# EAGLE design tamagotya (EAGLE 9.4.0)

## Sheet 1 of 4
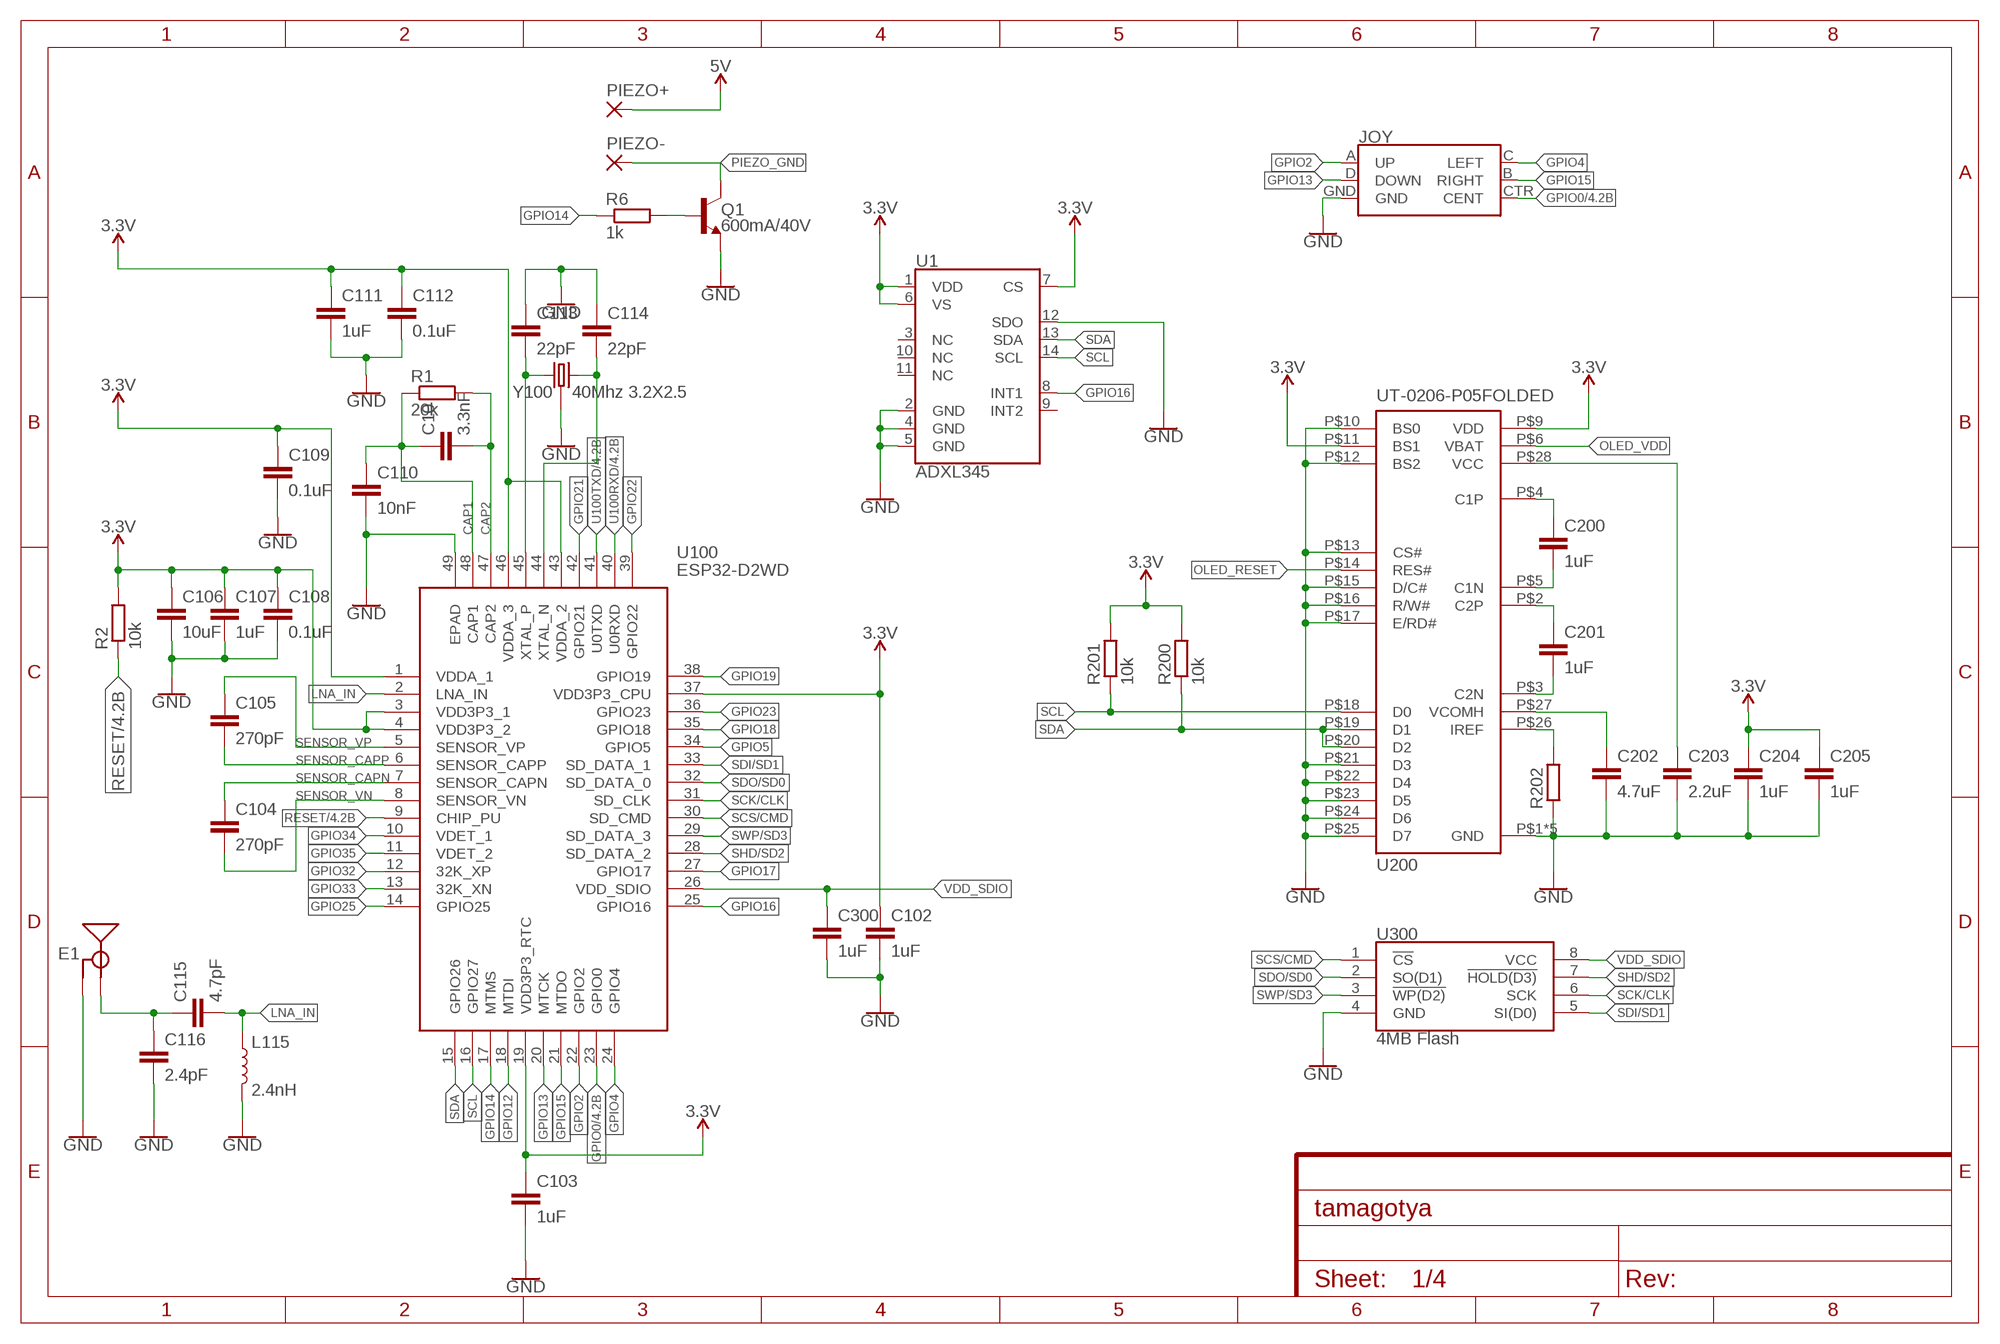
[diagram p0: schematic, sheet 1]

### Parts
C10  3.3nF  C-EUC0603  [C0603]
C102  1uF  C-EUC0603  [C0603]
C103  1uF  C-EUC0603  [C0603]
C104  270pF  C-EUC0603  [C0603]
C105  270pF  C-EUC0603  [C0603]
C106  10uF  C-EUC0603  [C0603]
C107  1uF  C-EUC0603  [C0603]
C108  0.1uF  C-EUC0603  [C0603]
C109  0.1uF  C-EUC0603  [C0603]
C110  10nF  C-EUC0603  [C0603]
C111  1uF  C-EUC0603  [C0603]
C112  0.1uF  C-EUC0603  [C0603]
C113  22pF  C-EUC0603  [C0603]
C114  22pF  C-EUC0603  [C0603]
C115  4.7pF  C-EUC0603  [C0603]
C116  2.4pF  C-EUC0603  [C0603]
C200  1uF  C-EUC0603  [C0603]
C201  1uF  C-EUC0603  [C0603]
C202  4.7uF  C-EUC0603  [C0603]
C203  2.2uF  C-EUC0603  [C0603]
C204  1uF  C-EUC0603  [C0603]
C205  1uF  C-EUC0603  [C0603]
C300  1uF  C-EUC0603  [C0603]
E1  ANTENNA-GROUNDEDTRACE-15.2MM  [TRACE_ANTENNA_2.4GHZ_15.2MM]
JOY  JOYSTICK_MINI  [JOYSTICK_MINI]
L115  2.4nH  INDUCTOR-0603-33NH  [0603]
PIEZO+  WIREPADSMD1,27-254  [SMD1,27-2,54]
PIEZO-  WIREPADSMD1,27-254  [SMD1,27-2,54]
Q1  600mA/40V  TRANS_NPN-MMBT2222AL  [SOT23-3]
R1  20k  R-EU_R0603  [R0603]
R2  10k  R-EU_R0603  [R0603]
R6  1k  R-EU_R0603  [R0603]
R200  10k  R-EU_R0603  [R0603]
R201  10k  R-EU_R0603  [R0603]
R202  R-EU_R0603  [R0603]
U1  ADXL345  [LGA-14]
U100  ESP32-D2WD  [QFN35P500X500X90-49N]
U200  UT-0206-P05FOLDED  [UT-0206-P05-FOLD]
U300  4MB Flash  AT25SF041  [SO08]
Y100  40Mhz 3.2X2.5  CRYSTAL-26MHZSMD-3.2X2.5  [CRYSTAL-SMD-3.2X2.5MM]

### Nets
3.3V: C102.1 C103.1 C106.1 C107.1 C108.1 C109.1 C111.1 C112.1 C204.1 C205.1 R2.2 R200.2 R201.2 U1.1(VDD) U1.6(VS) U1.7(CS) U100.1(VDDA_1) U100.3(VDD3P3_1) U100.4(VDD3P3_2) U100.19(VDD3P3_RTC) U100.37(VDD3P3_CPU) U100.43(VDDA_2) U100.46(VDDA_3) U200.P$9(VDD) U200.P$11(BS1) ; also sheet 3
5V: PIEZO+.1(P) ; also sheet 3
CAP1: C10.1 C110.1 R1.1 U100.48(CAP1)
CAP2: C10.2 R1.2 U100.47(CAP2)
GND: C102.2 C103.2 C106.2 C107.2 C108.2 C109.2 C110.2 C111.2 C112.2 C113.1 C114.1 C116.2 C202.2 C203.2 C204.2 C205.2 C300.2 E1.GND JOY.GND L115.2 Q1.2(E) R202.1 U1.2(GND) U1.4(GND) U1.5(GND) U1.12(SDO) U100.49(EPAD) U200.P$1(GND) U200.P$7(GND) U200.P$8(GND) U200.P$10(BS0) U200.P$12(BS2) U200.P$13(CS#) U200.P$15(D/C#) U200.P$16(R/W#) U200.P$17(E/RD#) U200.P$21(D3) U200.P$22(D4) U200.P$23(D5) U200.P$24(D6) U200.P$25(D7) U200.P$29(GND) U200.P$30(GND) U300.4(GND) Y100.2 Y100.4 ; also sheet 2,3,4
GPIO0: JOY.CTR(CENT) U100.23(GPIO0) ; also sheet 4
GPIO2: JOY.A(UP) U100.22(GPIO2)
GPIO4: JOY.C(LEFT) U100.24(GPIO4)
GPIO5: U100.34(GPIO5)
GPIO12: U100.18(MTDI)
GPIO13: JOY.D(DOWN) U100.20(MTCK)
GPIO14: R6.1 U100.17(MTMS)
GPIO15: JOY.B(RIGHT) U100.21(MTDO)
GPIO16: U1.8(INT1) U100.25(GPIO16)
GPIO17: U100.27(GPIO17)
GPIO18: U100.35(GPIO18)
GPIO19: U100.38(GPIO19)
GPIO21: U100.42(GPIO21)
GPIO22: U100.39(GPIO22)
GPIO23: U100.36(GPIO23)
GPIO25: U100.14(GPIO25)
GPIO32: U100.12(32K_XP)
GPIO33: U100.13(32K_XN)
GPIO34: U100.10(VDET_1)
GPIO35: U100.11(VDET_2)
LNA_IN: C115.2 L115.1 U100.2(LNA_IN)
N$5: Q1.1(B) R6.2
N$7: C115.1 C116.1 E1.ANT(SIGNAL)
N$10: R202.2 U200.P$26(IREF)
N$11: C202.1 U200.P$27(VCOMH)
N$12: C200.1 U200.P$4(C1P)
N$13: C200.2 U200.P$5(C1N)
N$14: C201.1 U200.P$2(C2P)
N$15: C201.2 U200.P$3(C2N)
N$16: C203.1 U200.P$28(VCC)
OLED_RESET: U200.P$14(RES#)
OLED_VDD: U200.P$6(VBAT)
PIEZO_GND: PIEZO-.1(P) Q1.3(C)
RESET: R2.1 U100.9(CHIP_PU) ; also sheet 4
SCK/CLK: U100.31(SD_CLK) U300.6(SCK)
SCL: R201.1 U1.14(SCL) U100.16(GPIO27) U200.P$18(D0)
SCS/CMD: U100.30(SD_CMD) U300.1(!CS)
SDA: R200.1 U1.13(SDA) U100.15(GPIO26) U200.P$19(D1) U200.P$20(D2)
SDI/SD1: U100.33(SD_DATA_1) U300.5(SI(D0))
SDO/SD0: U100.32(SD_DATA_0) U300.2(SO(D1))
SENSOR_CAPN: C104.1 U100.7(SENSOR_CAPN)
SENSOR_CAPP: C105.2 U100.6(SENSOR_CAPP)
SENSOR_VN: C104.2 U100.8(SENSOR_VN)
SENSOR_VP: C105.1 U100.5(SENSOR_VP) ; also sheet 2
SHD/SD2: U100.28(SD_DATA_2) U300.7(!HOLD(D3))
SWP/SD3: U100.29(SD_DATA_3) U300.3(!WP(D2))
U100RXD: U100.40(U0RXD) ; also sheet 4
U100TXD: U100.41(U0TXD) ; also sheet 4
VDD_SDIO: C300.1 U100.26(VDD_SDIO) U300.8(VCC)
XTAL_P: C113.2 U100.45(XTAL_P) Y100.1
XTAN_N: C114.2 U100.44(XTAL_N) Y100.3
Unconnected: U1.3(NC) U1.9(INT2) U1.10(NC) U1.11(NC)

## Sheet 2 of 4: Charge Circuit
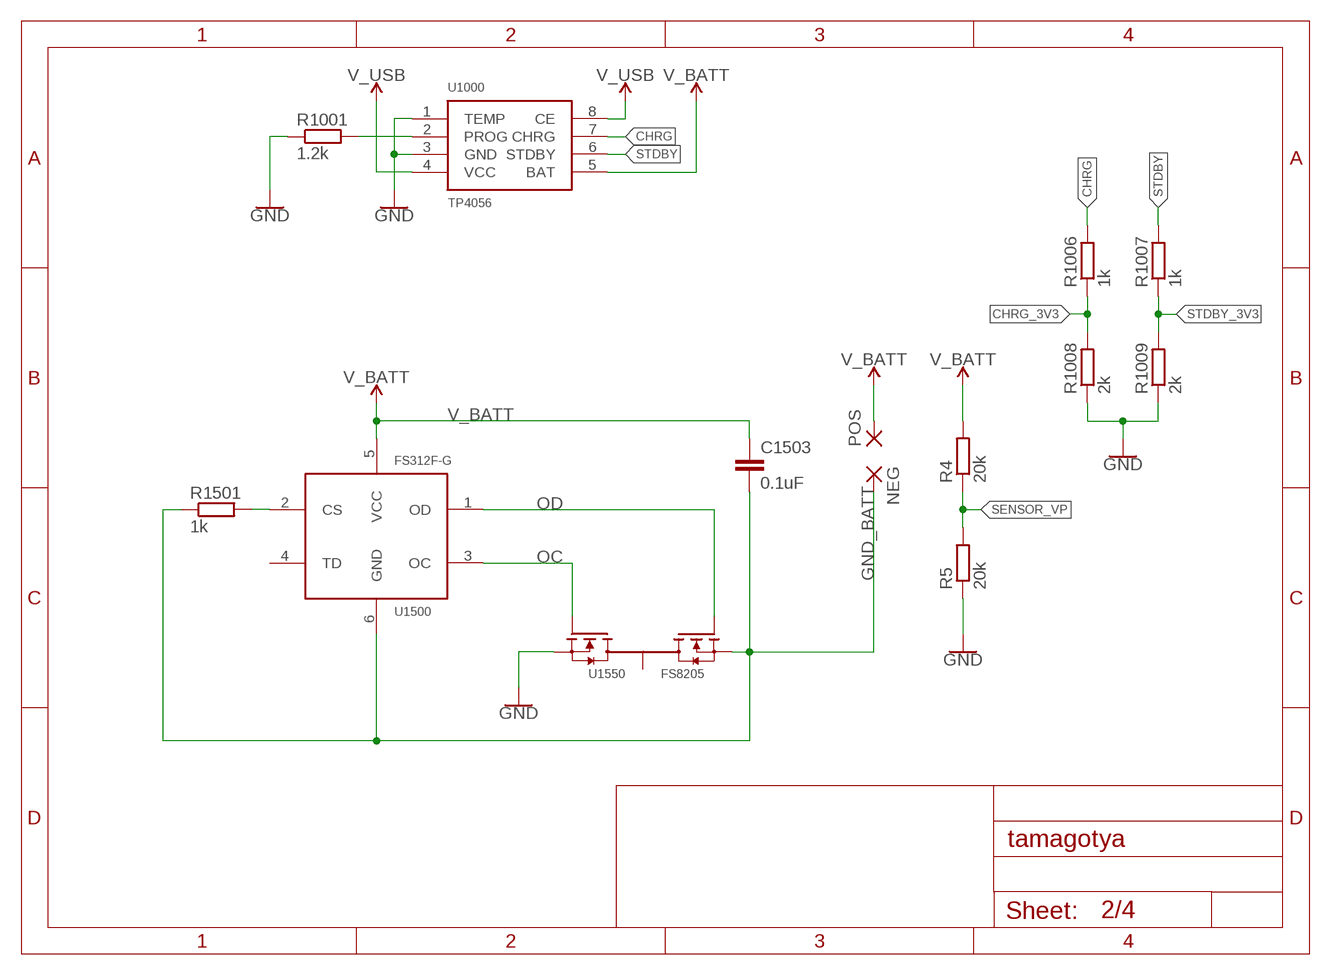
[diagram p1: schematic, sheet 2]

### Parts
C1503  0.1uF  C-EUC0603  [C0603]
NEG  SMD5  [SMD2,54-5,08]
POS  SMD5  [SMD2,54-5,08]
R4  20k  R-EU_R0603  [R0603]
R5  20k  R-EU_R0603  [R0603]
R1001  1.2k  R-EU_R0603  [R0603]
R1006  1k  R-EU_R0603  [R0603]
R1007  1k  R-EU_R0603  [R0603]
R1008  2k  R-EU_R0603  [R0603]
R1009  2k  R-EU_R0603  [R0603]
R1501  1k  R-EU_R0603  [R0603]
U1000  TP4056  [SOP-8]
U1500  FS312F-G  [SOT23-6]
U1550  FS8205  [SOT23-6]

### Nets
CHRG: R1006.2 U1000.7(CHRG)
CHRG_3V3: R1006.1 R1008.2
FS_CS: R1501.2 U1500.2(CS)
GND: R5.1 R1001.1 R1008.1 R1009.1 U1000.1(TEMP) U1000.3(GND) U1550.1(S1) ; also sheet 1,3,4
GND_BATT: C1503.2 NEG.1(P) R1501.1 U1500.6(GND) U1550.3(S2)
N$4: R1001.2 U1000.2(PROG)
OC: U1500.3(OC) U1550.6(G1)
OD: U1500.1(OD) U1550.4(G2)
SENSOR_VP: R4.1 R5.2 ; also sheet 1
STDBY: R1007.2 U1000.6(STDBY)
STDBY_3V3: R1007.1 R1009.2
V_BATT: C1503.1 POS.1(P) R4.2 U1000.5(BAT) U1500.5(VCC) ; also sheet 3
V_USB: U1000.4(VCC) U1000.8(CE) ; also sheet 4
Unconnected: U1500.4(TD) U1550.2(D12) U1550.5(D12)

## Sheet 3 of 4: Regulators
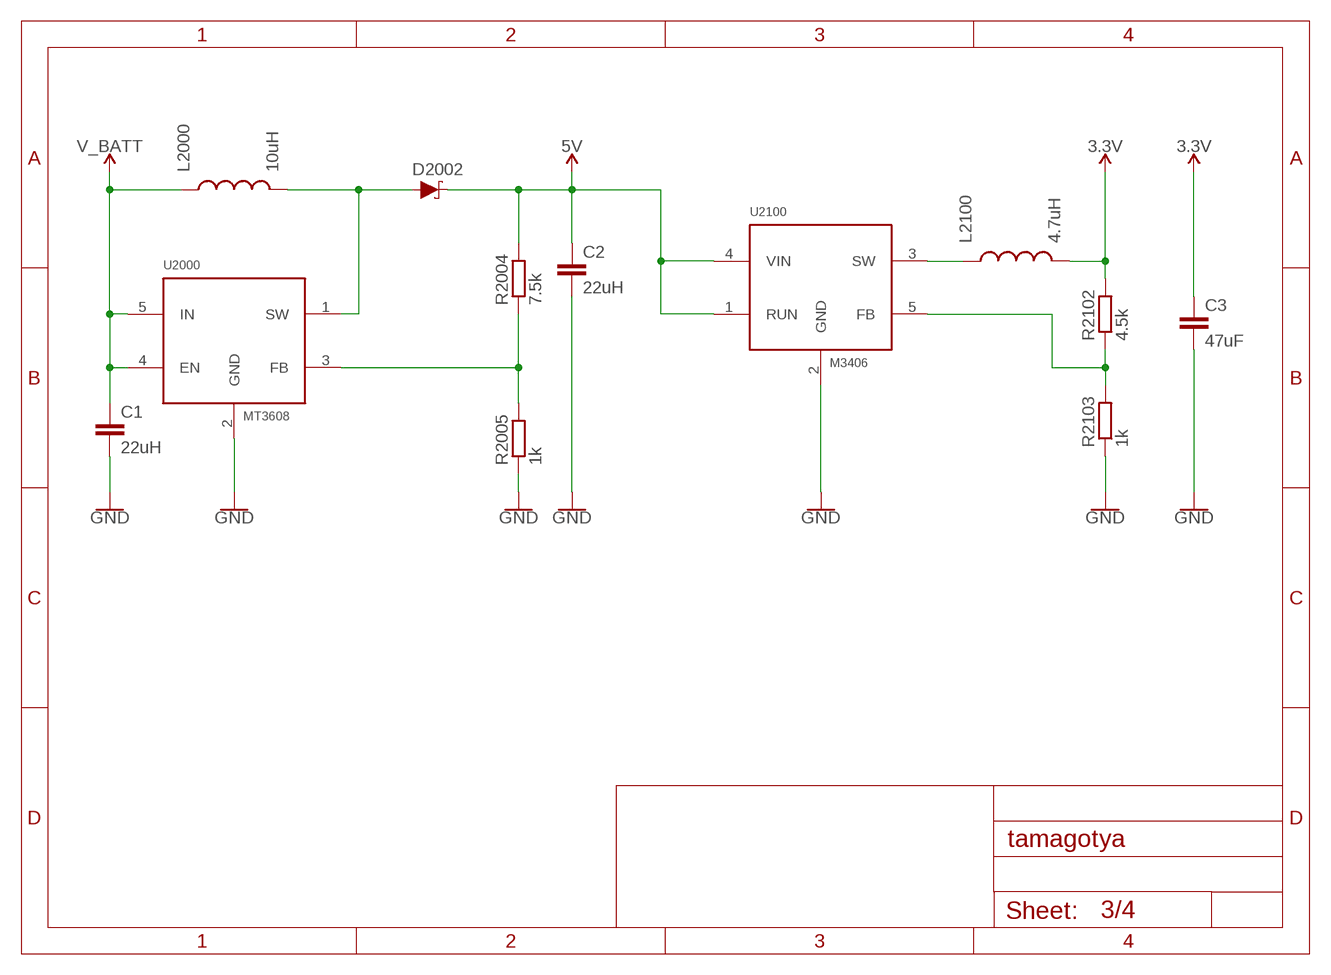
[diagram p2: schematic, sheet 3]

### Parts
C1  22uH  C-EUC0603  [C0603]
C2  22uH  C-EUC0603  [C0603]
C3  47uF  C-EUC0805  [C0805]
D2002  DIODE-SCHOTTKY-PMEG4005EJ  [SOD-323]
L2000  10uH  INDUCTOR3.0X3.0  [INDUCTOR_3.0X3.0]
L2100  4.7uH  INDUCTOR3.0X3.0  [INDUCTOR_3.0X3.0]
R2004  7.5k  R-EU_R0603  [R0603]
R2005  1k  R-EU_R0603  [R0603]
R2102  4.5k  R-EU_R0603  [R0603]
R2103  1k  R-EU_R0603  [R0603]
U2000  MT3608  [SOT23-6]
U2100  M3406  [SOT23-5]

### Nets
3.3V: C3.1 L2100.P$2 R2102.2 ; also sheet 1
5V: C2.1 D2002.C R2004.2 U2100.1(RUN) U2100.4(VIN) ; also sheet 1
BUCK: D2002.A L2000.P$2 U2000.1(SW)
GND: C1.2 C2.2 C3.2 R2005.1 R2103.1 U2000.2(GND) U2100.2(GND) ; also sheet 1,2,4
N$3: R2004.1 R2005.2 U2000.3(FB)
N$8: L2100.P$1 U2100.3(SW)
N$9: R2102.1 R2103.2 U2100.5(FB)
V_BATT: C1.1 L2000.P$1 U2000.4(EN) U2000.5(IN) ; also sheet 2

## Sheet 4 of 4: UART
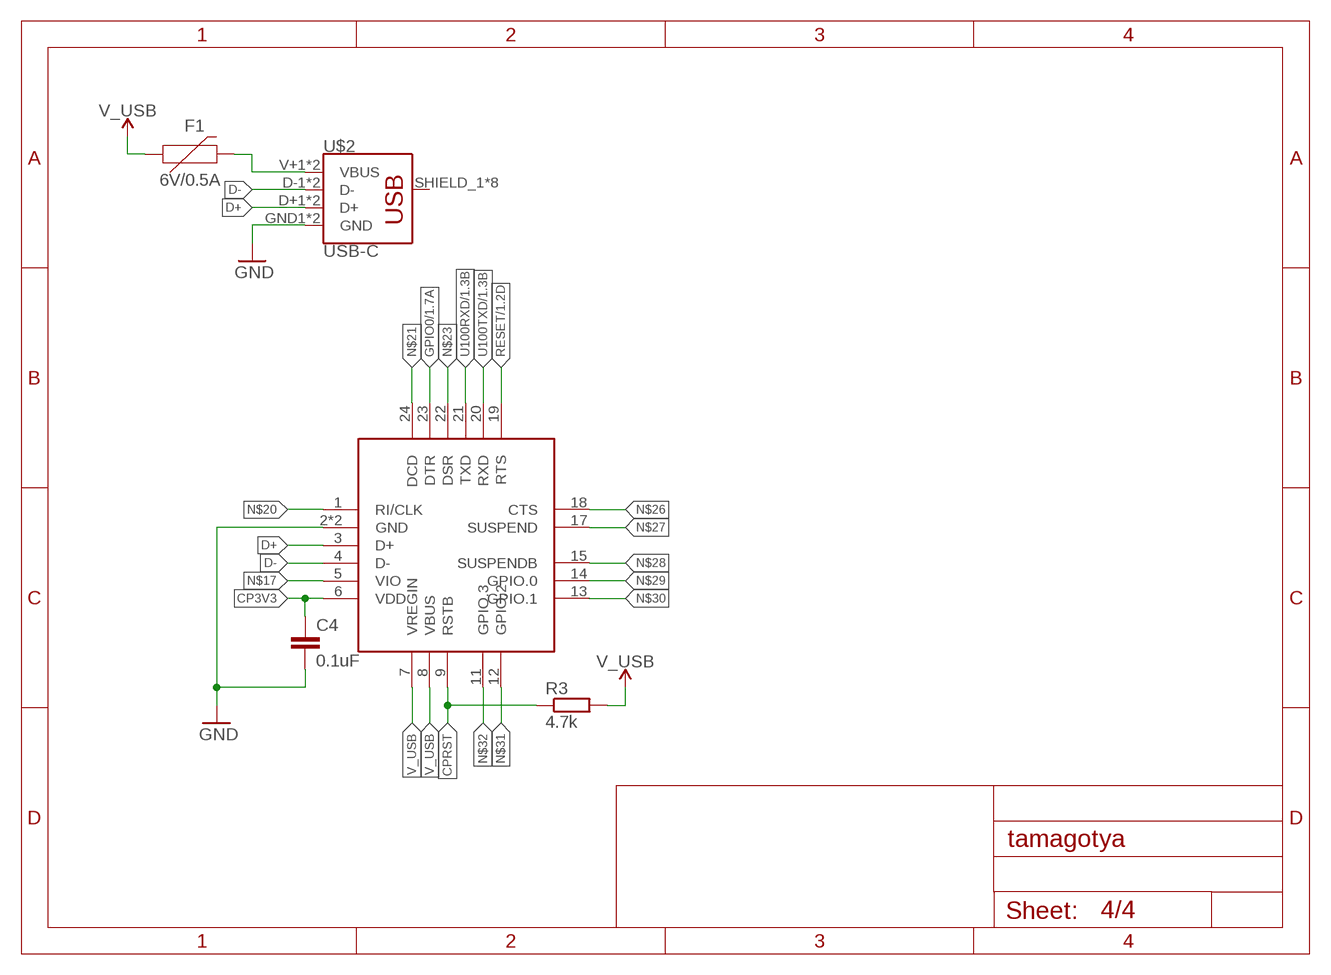
[diagram p3: schematic, sheet 4]

### Parts
C4  0.1uF  C-EUC0603  [C0603]
F1  6V/0.5A  PPTC_HALF-AMP  [1206]
R3  4.7k  R-EU_R0603  [R0603]
U$2  USB-C  [USB_C-XKBENTERPRISEU262-16XN-4BVC11]
U$3  CP2102N-QFN24  [QFN24-4X4]

### Nets
CP3V3: C4.1 U$3.6(VDD)
CPRST: R3.1 U$3.9(RSTB)
D+: U$2.D+1(D+) U$2.D+2(D+) U$3.3(D+)
D-: U$2.D-1(D-) U$2.D-2(D-) U$3.4(D-)
GND: C4.2 U$2.GND1(GND) U$2.GND2(GND) U$3.2(GND) U$3.EXP(GND) ; also sheet 1,2,3
GPIO0: U$3.23(DTR) ; also sheet 1
N$17: U$3.5(VIO)
N$20: U$3.1(RI/CLK)
N$21: U$3.24(DCD)
N$23: U$3.22(DSR)
N$26: U$3.18(CTS)
N$27: U$3.17(SUSPEND)
N$28: U$3.15(SUSPENDB)
N$29: U$3.14(GPIO.0)
N$30: U$3.13(GPIO.1)
N$31: U$3.12(GPIO.2)
N$32: U$3.11(GPIO.3)
RESET: U$3.19(RTS) ; also sheet 1
U100RXD: U$3.21(TXD) ; also sheet 1
U100TXD: U$3.20(RXD) ; also sheet 1
V_USB: F1.1 R3.2 U$3.7(VREGIN) U$3.8(VBUS) ; also sheet 2
V_USB_UNFUSED: F1.2 U$2.V+1(VBUS) U$2.V+2(VBUS)
Unconnected: U$2.SHIELD_1(SHIELD) U$2.SHIELD_2(SHIELD) U$2.SHIELD_3(SHIELD) U$2.SHIELD_4(SHIELD) U$2.SHIELD_5(SHIELD) U$2.SHIELD_6(SHIELD) U$2.SHIELD_7(SHIELD) U$2.SHIELD_8(SHIELD)

## Library data of the parts
C1-C4 C10 C102-C116 C200-C205 C300 C1503 = rcl:C-EU: CAPACITOR, European symbol; SPICEPREFIX: C
D2002 = SparkFun-DiscreteSemi:DIODE-SCHOTTKY: Schottky diode A Schottky diode is a semiconductor diode which has a low forward voltage drop and a very fast switching action.; PROD_ID: DIO-10955; VALUE: 0.5A/40V/420mV
E1 = SparkFun-RF:ANTENNA-GROUNDED: Antenna w/ Ground Connection 2.4GHz antennae with signal and ground terminals. TRACE_ANTENNA_2.4GHZ_15.2MM - Meander Trace antenna 15.2 x 5.7mm footprint Based on layout from TI app note AN043 <http://www.ti.com/lit/an/swra117d/swra117d.pdf>. TRACE_ANTENNA_2.4GHZ_25.7MM - Inverted F trace antenna 25.7 x 7.5 mm footprint. Based on layout from TI design note DN0007 <http://www.ti.com/lit/an/swru120b/swru120b.pdf>.
F1 = SparkFun-Fuses:PPTC: Resettable Fuse PPTC Resettable Fuse. Really a sort of resistor with a polymeric positive temperature coefficient whose resistance increases dramatically with an increase in temperature. When heated by the power passing through the resistance rises causing the current to be limited, protecting the circuit. This is achieved by the transition of the polymer from a crystalline to an amorphous state where the conductive carbon separates breaking the conductive pathways found in the cool crystalline structure. When a PPTC cools back down it resumes conducting letting the circuit turn back on. SparkFun Products: SparkFun RedBoard - Programmed with Arduino <https://www.sparkfun.com/products/12757> Pro Micro - 5V/16MHz <https://www.sparkfun.com/products/12640> Arduino Pro 328 - 5V/16MHz <https://www.sparkfun.com/products/10915> MP3 Trigger <https://www.sparkfun.com/products/13720>; PROD_ID: RES-08585
JOY = SparkFun-Switches:JOYSTICK_MINI: Small Tactile Joystick w/ Select Switch A 5-way tactile switch allows for a joystick-like interface in a very small package. Part #: 4UCON SF303GJ26 SparkFun Products 5-way Tactile Switch <https://www.sparkfun.com/products/10063> (COM-10063) Used on SparkFun Block for Intel® Edison - OLED <https://www.sparkfun.com/products/13035> (DEV-13035) Used on CAN-BUS Shield <https://www.sparkfun.com/products/13262> (DEV-13262); PROD_ID: SWCH-09905; SF_SKU: COM-10063
L115 = SparkFun-Coils:INDUCTOR: Inductors Resist changes in electrical current. Basically a coil of wire. SparkFun Products: SparkFun Load Cell Amplifier - HX711 <https://www.sparkfun.com/products/13879> IOIO-OTG - V2.2 <https://www.sparkfun.com/products/13613>; PROD_ID: NDUC-07874; VALUE: 33nH/±5%/500mA
L2000 L2100 = geusebio:INDUCTOR
NEG POS = wirepad:SMD5: SMD PAD
PIEZO+ PIEZO- = wirepad:WIREPAD: Wire PAD connect wire on PCB
Q1 = SparkFun-DiscreteSemi:TRANS_NPN: NPN transistor Current controlled devices typically used to amplify current or used as a switch. BC547 - COM-08928 <http://www.sparkfun.com/products/8928> (TO-92 45V 100mA) (1.Collector 2.Base 3.Emitter) 2N3904 - COM-00521 <http://www.sparkfun.com/products/521> (TO-92 40V 200mA) (1.Emitter 2.Base 3.Collector) P2N2222A - COM-12852 <http://www.sparkfun.com/products/12852> (TO-92 40V 600mA) (1.Collector 2.Base 3.Emitter); PROD_ID: TRANS-08049
R1-R6 R200-R202 R1001 R1006-R1009 R1501 R2004 R2005 R2102 R2103 = rcl:R-EU_: RESISTOR, European symbol; SPICEPREFIX: R
U1 = SparkFun-Sensors:ADXL345: Analog Devices ADXL345 3-Axis SPI/I2C 2/4/8/16g Accelerometer The ADXL345 is a small, thin, low power, 3-axis accelerometer with high resolution (13-bit) measurement at up to ±16g. Digital output data is formatted as 16-bit twos complement and is accessible through either a SPI (3- or 4-wire) or I2C digital interface. Datasheet <https://www.sparkfun.com/datasheets/Sensors/Accelerometer/ADXL345.pdf> SparkFun Products SparkFun Triple Axis Accelerometer Breakout - ADXL345 <https://www.sparkfun.com/products/9836> (SEN-09836) Triple Axis Accelerometer - ADXL345 <https://www.sparkfun.com/products/9045> (SEN-09045) SparkFun 6 Degrees of Freedom IMU Digital Combo Board - ITG3200/ADXL345 <https://www.sparkfun.com/products/10121> (SEN-10121); PROD_ID: IC-09097; SF_ID: SEN-09045
U100 = ESP32-D2WD:ESP32-D2WD: RF System on a Chip - SoC SMD IC ESP32-D2WD, Dual Core MCU, WiFi & Bluetooth Combo, 2MByte Flash inside, QFN48 Source: Datasheet <https://www.mouser.it/datasheet/2/891/esp32_datasheet_en-1223853.pdf>; DESCRIPTION: RF System on a Chip - SoC SMD IC ESP32-D2WD, Dual Core MCU, WiFi & Bluetooth Combo, 2MByte Flash inside, QFN48; HEIGHT: 0.9mm; MANUFACTURER_NAME: Espressif; MANUFACTURER_PART_NUMBER: ESP32-D2WD; MOUSER_PART_NUMBER: 356-ESP32-D2WD
U200 = geusebio:UT-0206-P05
U300 = SparkFun-IC-Memory:AT25SF041: AT25SF041 4Mb Serial Flash Memory 104MHz, SPI, 8-SOIC Datasheet <http://www.adestotech.com/wp-content/uploads/DS-AT25SF041_044.pdf> SparkFun Products: SparkFun ESP8266 Thing <https://www.sparkfun.com/products/13231> SparkFun ESP8266 Thing - Dev Board <https://www.sparkfun.com/products/13711>; PROD_ID: IC-12455
U1000 = geusebio:TP4056
U1500 = geusebio:FS312F-G
U1550 = geusebio:FS8205
U2000 = geusebio:MT3608
U2100 = geusebio:M3406
U$2 = geusebio:USB-C
U$3 = geusebio:CP2102N-QFN24
Y100 = SparkFun-Clocks:CRYSTAL-26MHZ: 26MHz Crystal w/ Ground Pin Digikey Example <http://www.digikey.com/product-detail/en/epson/TSX-3225%2026.0000MF09Z-AC3/SER3627CT-ND/1802878> Frequency: 26MHz Frequency Stability: ±9ppm Frequency Tolerance: ±10ppm Load Capacitance: 9pF SparkFun Products: SparkFun ESP32 Thing <https://www.sparkfun.com/products/13907> SparkFun ESP8266 Thing Dev Board <https://www.sparkfun.com/products/13711>; PROD_ID: XTAL-12454

## Board
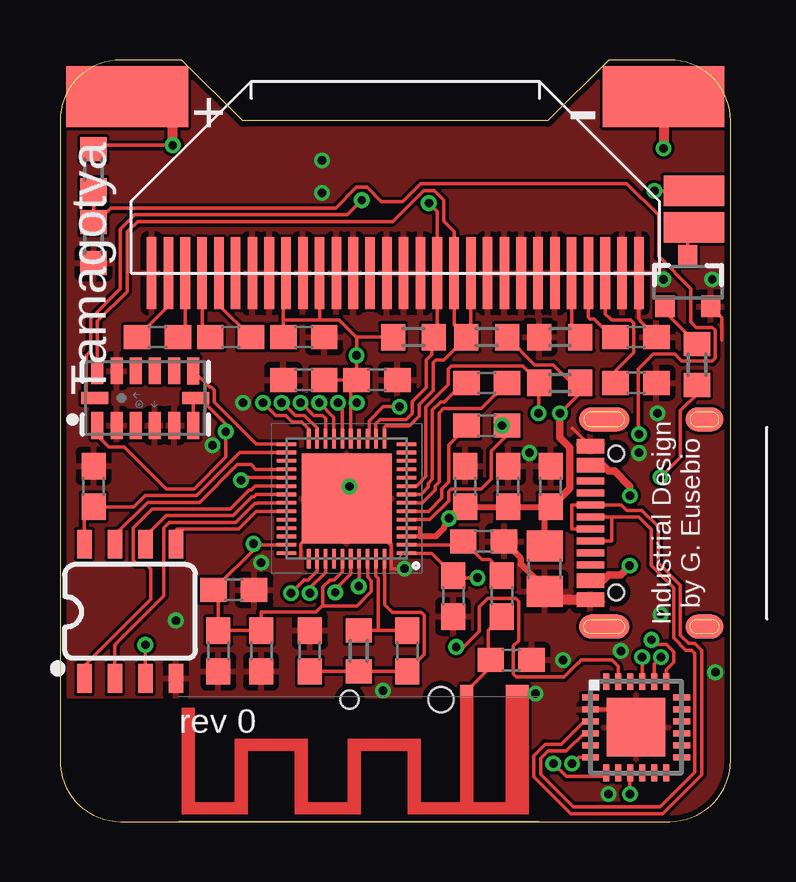
[diagram p4: board, top side]
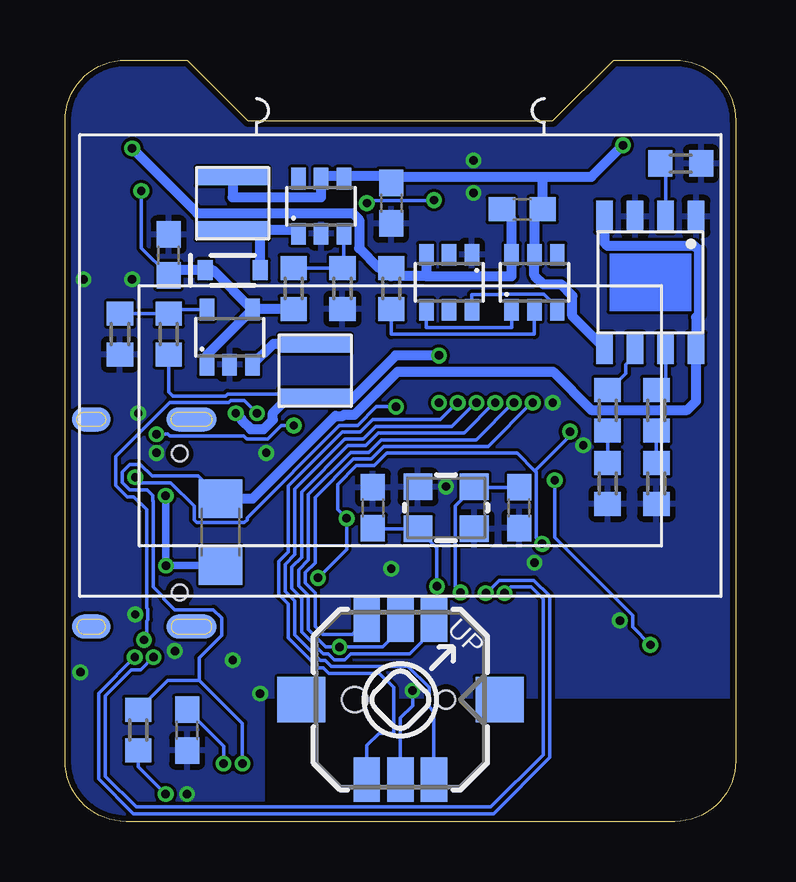
[diagram p5: board, bottom side, seen from below]

Size 27.94 x 31.75 mm. Coordinates in mm from the lower left corner, seen from the top.
Outline: 0,29.21 0,2.54 arc90 2.54,0 25.4,0 arc90 27.94,2.54 27.94,29.21 arc90 25.4,31.75 22.86,31.75 20.32,29.21 7.62,29.21 5.08,31.75 2.54,31.75 arc90 0,29.21
Copper layers (1*16): Top 0.035mm / dielectric 1.5mm / Bottom 0.035mm
Design rules "dirtypcbs": minimum track width 5mil, minimum drill 12mil, track to track 5mil, track to pad 5mil, pad to pad 5mil, via to via 5mil, smd to smd 0mil, copper to edge 10mil, drill to drill 10mil, minimum pad ring 10mil, minimum via ring 6mil, stop-mask expansion 2mil, vias tented up to drill 25mil, thermal gap 10mil

### Footprints (pad centres in the part's own frame; a part is rotated, then mirrored left to right if it is on the bottom)
C0603 = smd 1.1 x 1: 1 -0.85,0; 2 0.85,0
C0805 = smd 1.3 x 1.5: 1 -0.95,0; 2 0.95,0
SOD-323 = smd 0.63 x 0.83: A 1.15,0; C -1.15,0
TRACE_ANTENNA_2.4GHZ_15.2MM = smd 0.5 x 0.5: ANT 0,-0.25 | smd 0.9 x 0.5: GND -2.1,-0.25
1206 = smd 1.6 x 1.8: 1 -1.4,0; 2 1.4,0
JOYSTICK_MINI = smd 1.85 x 1.1: A -3.325,1.4; B 3.325,1.4; C -3.325,-1.4; CTR -3.325,0; D 3.325,-1.4; GND 3.325,0 | smd 1.9 x 2: NC 0,4.13; NC@0 0,-4.13 | hole 0.75: 0,1.9 | hole 1.05: 0,-1.9
0603 = smd 1.1 x 1: 1 -0.85,0; 2 0.85,0
INDUCTOR_3.0X3.0 = smd 0.75 x 3: P$1 -1.125,0; P$2 1.125,0
SMD2,54-5,08 = smd 2.54 x 5.08: 1 0,0
SMD1,27-2,54 = smd 1.27 x 2.54: 1 0,0
SOT23-3 = smd 0.8 x 0.9: 1 -0.95,-1; 2 0.95,-1; 3 0,1.1
R0603 = smd 1 x 1.1: 1 -0.85,0; 2 0.85,0
LGA-14 = smd 0.5 x 1.124: 1 2,1.138; 2 1.2,1.138; 3 0.4,1.138; 4 -0.4,1.138; 5 -1.2,1.138; 6 -2,1.138; 8 -2,-1.13; 9 -1.2,-1.138; 10 -0.4,-1.138; 11 0.4,-1.138; 12 1.2,-1.138; 13 2,-1.138 | smd 1.124 x 0.5: 7 -2.1,0; 14 2.1,0
QFN35P500X500X90-49N = smd 0.8 x 0.15: 1 -2.5,2.275; 2 -2.5,1.925; 3 -2.5,1.575; 4 -2.5,1.225; 5 -2.5,0.875; 6 -2.5,0.525; 7 -2.5,0.175; 8 -2.5,-0.175; 9 -2.5,-0.525; 10 -2.5,-0.875; 11 -2.5,-1.225; 12 -2.5,-1.575; 13 -2.5,-1.925; 14 -2.5,-2.275; 25 2.5,-2.275; 26 2.5,-1.925; 27 2.5,-1.575; 28 2.5,-1.225; 29 2.5,-0.875; 30 2.5,-0.525; 31 2.5,-0.175; 32 2.5,0.175; 33 2.5,0.525; 34 2.5,0.875; 35 2.5,1.225; 36 2.5,1.575; 37 2.5,1.925; 38 2.5,2.275 | smd 0.15 x 0.8: 15 -1.575,-2.5; 16 -1.225,-2.5; 17 -0.875,-2.5; 18 -0.525,-2.5; 19 -0.175,-2.5; 20 0.175,-2.5; 21 0.525,-2.5; 22 0.875,-2.5; 23 1.225,-2.5; 24 1.575,-2.5; 39 1.575,2.5; 40 1.225,2.5; 41 0.875,2.5; 42 0.525,2.5; 43 0.175,2.5; 44 -0.175,2.5; 45 -0.525,2.5; 46 -0.875,2.5; 47 -1.225,2.5; 48 -1.575,2.5 | smd 3.75 x 3.75: 49 0,0
UT-0206-P05-FOLD = smd 0.4 x 3 bottom: P$1 -10.15,7.62; P$2 -9.45,7.62; P$3 -8.75,7.62; P$4 -8.05,7.62; P$5 -7.35,7.62; P$6 -6.65,7.62; P$7 -5.95,7.62; P$8 -5.25,7.62; P$9 -4.55,7.62; P$10 -3.85,7.62; P$11 -3.15,7.62; P$12 -2.45,7.62; P$13 -1.75,7.62; P$14 -1.05,7.62; P$15 -0.35,7.62; P$16 0.35,7.62; P$17 1.05,7.62; P$18 1.75,7.62; P$19 2.45,7.62; P$20 3.15,7.62; P$21 3.85,7.62; P$22 4.55,7.62; P$23 5.25,7.62; P$24 5.95,7.62; P$25 6.65,7.62; P$26 7.35,7.62; P$27 8.05,7.62; P$28 8.75,7.62; P$29 9.45,7.62; P$30 10.15,7.62
SO08 = smd 0.6 x 1.2: 1 -1.905,-2.8; 2 -0.635,-2.8; 3 0.635,-2.8; 4 1.905,-2.8; 5 1.905,2.8; 6 0.635,2.8; 7 -0.635,2.8; 8 -1.905,2.8
SOP-8 = smd 1.3 x 0.7: 1 -2.75,1.905; 2 -2.75,0.635; 3 -2.75,-0.635; 4 -2.75,-1.905; 5 2.75,-1.905; 6 2.75,-0.635; 7 2.75,0.635; 8 2.75,1.905
SOT23-6 = smd 0.6 x 0.9: 1 -0.95,-1.15; 2 0,-1.15; 3 0.95,-1.15; 4 0.95,1.15; 5 0,1.15; 6 -0.95,1.15
SOT23-5 = smd 0.6 x 0.9: 1 -0.95,-1.15; 2 0,-1.15; 3 0.95,-1.15; 4 0.95,1.15; 5 -0.95,1.15
USB_C-XKBENTERPRISEU262-16XN-4BVC11 = smd 0.3 x 1.15: CC1 -1.25,0; CC2 1.75,0; D+1 -0.25,0; D+2 0.75,0; D-1 -0.75,0; D-2 0.25,0; SBU1 1.25,0; SBU2 -1.75,0 | smd 0.6 x 1.15: GND1 -3.2,0; GND2 3.2,0; V+1 -2.4,0; V+2 2.4,0 | smd 1 x 1.6 bottom: SHIELD_1 -4.32,-4.755; SHIELD_8 4.32,-4.755 | smd 1 x 2.1 bottom: SHIELD_2 -4.32,-0.575; SHIELD_7 4.32,-0.575 | smd 1 x 1.6: SHIELD_3 -4.32,-4.755; SHIELD_6 4.32,-4.755 | smd 1 x 2.1: SHIELD_4 -4.32,-0.575; SHIELD_5 4.32,-0.575 | hole 0.65: -2.89,-1.075; 2.89,-1.075
QFN24-4X4 = smd 0.7 x 0.25: 1 -1.9,1.25; 2 -1.9,0.75; 3 -1.9,0.25; 4 -1.9,-0.25; 5 -1.9,-0.75; 6 -1.9,-1.25; 13 1.9,-1.25; 14 1.9,-0.75; 15 1.9,-0.25; 16 1.9,0.25; 17 1.9,0.75; 18 1.9,1.25 | smd 0.25 x 0.7: 7 -1.25,-1.9; 8 -0.75,-1.9; 9 -0.25,-1.9; 10 0.25,-1.9; 11 0.75,-1.9; 12 1.25,-1.9; 19 1.25,1.9; 20 0.75,1.9; 21 0.25,1.9; 22 -0.25,1.9; 23 -0.75,1.9; 24 -1.25,1.9 | smd 2.45 x 2.45: EXP 0,0
CRYSTAL-SMD-3.2X2.5MM = smd 1.2 x 1.1: 1 -1.175,-0.875; 2 1.175,-0.875; 3 1.175,0.875; 4 -1.175,0.875

### Placement (x,y rotation side)
C1  14.35,25.78 270 bottom
C2  23.62,23.62 90 bottom
C3  20.19,10.54 270 top
C4  22.86,3.81 270 bottom
C10  14.48,7.11 90 top
C102  7.24,9.65 0 top
C103  10.16,18.41 180 top
C104  17.78,18.29 180 top
C105  17.78,16.51 180 top
C106  20.45,13.97 90 top
C107  18.67,13.97 90 top
C108  16.89,13.97 90 top
C109  16.38,9.4 270 top
C110  10.41,7.11 90 top
C111  6.6,7.11 270 top
C112  8.38,7.11 270 top
C113  15.11,13.08 270 bottom
C114  9.02,13.08 90 bottom
C115  18.41,9.4 90 top
C116  18.8,6.73 0 top
C200  7.11,20.19 0 top
C201  4.06,20.19 0 top
C202  24,20.19 0 top
C203  24,18.29 0 top
C204  13.21,18.41 0 top
C205  10.16,20.19 0 top
C300  1.4,13.97 90 top
C1503  8.89,25.53 180 bottom
D2002  20.95,22.99 0 bottom
E1  16.95,5.21 180 top
F1  21.46,12.06 270 bottom
JOY  13.97,5.08 270 bottom
L115  17.65,11.68 0 top
L2000  20.95,25.78 270 bottom
L2100  17.53,18.8 270 bottom
NEG  25.15,30.23 270 top
PIEZO+  26.42,26.29 270 top
PIEZO-  26.42,24.77 270 top
POS  2.79,30.23 270 top
Q1  26.16,22.48 0 top
R1  12.45,7.11 90 top
R2  20.83,18.29 0 top
R3  24.89,3.81 90 bottom
R4  1.4,27.18 90 top
R5  1.4,24.13 90 top
R6  26.54,19.05 90 top
R200  17.78,20.19 0 top
R201  14.73,20.19 180 top
R202  20.83,20.19 0 top
R1001  2.29,27.43 180 bottom
R1006  3.3,17.14 90 bottom
R1007  5.33,17.14 90 bottom
R1008  3.3,14.1 90 bottom
R1009  5.33,14.1 90 bottom
R1501  14.35,22.23 270 bottom
R2004  18.41,22.23 270 bottom
R2005  16.38,22.23 90 bottom
R2102  23.62,20.32 270 bottom
R2103  25.65,20.32 90 bottom
U1  3.56,17.65 180 top
U100  11.94,13.46 180 top
U200  13.97,30.48 180 bottom
U300  2.92,8.76 0 top
U1000  3.56,22.48 270 bottom
U1500  8.38,22.48 0 bottom
U1550  11.94,22.48 180 bottom
U2000  17.27,25.65 0 bottom
U2100  21.08,20.19 0 bottom
U$2  22.1,12.45 90 top
U$3  24,3.94 0 top
Y100  12.06,13.08 0 bottom

### Tracks (layer width: path | path; a pad name or v marks a point on that pad's centre or on a via)
3.3V  (via drill 0.35)
  Top 0.152: U100.1 15.49,11.19 16.38,10.3 | 12.36,20.18 v12.36,19.43 C204.1 12.11,18.41 | 12.36,20.18 11.64,20.9 10.79,20.9 | U200.P$9 9.31,22.75 9.31,20.95 | 9.31,20.95 C205.1 | R201.2 12.37,20.19 12.36,20.18 | 10.79,20.9 9.37,20.9 9.31,20.95 | 10.79,20.9 10.82,20.92 U200.P$11 | U100.46 12.81,10.19 12.98,10.03 12.98,9.59 12.38,8.99 10.92,8.99 | U100.43 11.76,10.41 11.43,10.08 11.25,10.08 10.94,9.77 10.94,9.01 10.92,8.99 | 12.11,18.41 U100.19 12.11,17.4 v12.36,17.46 | 12.11,18.41 C103.1 | 16.38,10.3 C109.1 | U100.4 14.99,12.24 14.99,11.89 U100.3 | 15.66,11.89 15.62,11.89 | R200.2 19.78,19.04 20.56,19.04 21.32,18.29 R2.2 21.68,17.87 v20.83,17.02 | 10.92,8.99 10.67,8.74 8.38,8.74 C112.1 C111.1 6.6,9.44 C102.1 8.27,11.54 | 16.38,10.3 16.52,10.16 v17.4,10.16 | 8.27,11.54 U100.37 | 8.27,11.54 8.23,11.58 v8.06,11.58 | U1.6 5.56,17.55 U1.7 5.97,17.65 6.14,17.48 6.14,17.34 6.91,16.57 v6.91,16.26 6.91,15.19 5.58,13.87 4.42,13.87 2.67,15.62 2.03,15.62 1.56,16.1 U1.1
  Top 0.254: C3.1 20.19,12.87 20.36,13.04 | 20.36,13.04 C106.1 | 20.36,13.04 20.28,13.12 C107.1 C108.1 16.21,12.44 16.15,12.44 16,12.29 16,12.23 15.66,11.89 | 15.62,11.89 14.99,11.89
  Top 0.305: v16.21,12.64 16.69,13.12 C108.1 | C106.1 20.49,13.12 21.24,13.88 21.24,15.59 20.83,16 v20.83,17.02
  Bottom 0.152: v17.4,10.16 16.21,11.35 v16.21,12.64 16.59,13.02 16.59,14.06 15.82,14.83 15.06,14.83 14.54,15.36 9.1,15.36 8.37,14.62 | 8.37,14.62 8.31,14.56 8.31,11.83 v8.06,11.58 | 18.8,17.53 18.69,17.53 | L2100.P$2 18.54,17.67 18.69,17.53 | R2102.2 23.62,17.91 23.46,17.75 21.24,17.75 21.16,17.83 18.69,17.83 18.69,17.53 | 8.37,14.62 6.91,16.08 v6.91,16.26
  Bottom 0.406: L2100.P$2 17.66,17.54 16.06,17.54 14.16,19.43 v12.36,19.43 | 18.8,17.53 19.28,17.04 19.28,16.75 19.67,16.36 20.21,16.36 20.6,16.75 20.6,16.79 v20.83,17.02
5V  (via drill 0.35)
  Top 0.152: PIEZO+.1 v24.77,26.29
  Bottom 0.152: C2.1 24.77,23.91 v24.77,26.29
  Bottom 0.406: U2100.4 21.78,22.99 D2002.C 23.41,22.99 C2.1 | R2004.2 20.1,21.38 U2100.4 | U2100.1 22.03,19.44 U2100.4
BUCK
  Bottom 0.406: U2000.1 18.37,24.66 19.81,24.66 | 19.81,24.66 L2000.P$2 | D2002.A 19.81,22.99 19.81,24.66
CAP1
  Top 0.152: C110.1 R1.1 C10.1 15.18,6.96 15.18,8.6 15.06,8.71 13.84,8.71 13.54,9.02 13.54,10.26 13.51,10.28 U100.48
CAP2
  Top 0.152: R1.2 13.16,7.96 13.26,7.96 | 13.26,7.96 C10.2 | U100.47 13.16,10.23 13.26,10.14 13.26,7.96
CHRG
  Bottom 0.152: U1000.7 2.92,18 R1006.2
CHRG_3V3
  Bottom 0.152: R1008.2 R1006.1
CP3V3  (via drill 0.35)
  Top 0.152: U$3.6 21.61,2.69 v21.34,2.41
  Bottom 0.152: v21.34,2.41 21.34,3.14 C4.1
CPRST  (via drill 0.35)
  Top 0.152: U$3.9 v23.75,1.14
  Bottom 0.152: v23.75,1.14 24.89,2.29 R3.1
D+
  Top 0.152: U$2.D+1 21.32,12.2 21.32,13.2 U$2.D+2 23.39,13.2 23.61,12.97 24.24,12.97 24.92,12.29 24.92,10.78 25.85,9.85 25.85,7.76 26.19,7.42 26.44,7.42 26.74,7.13 26.74,1.94 25.12,0.33 21.27,0.33 19.74,1.86 19.74,2.75 20.22,3.22 20.88,3.22 21.84,4.19 U$3.3
D-
  Top 0.152: U$2.D-1 22.99,11.7 22.99,12.7 | U$3.4 21.84,3.69 21.1,2.94 20.33,2.94 20.02,2.63 20.02,1.98 21.39,0.61 25.01,0.61 26.46,2.06 26.46,7.01 26.33,7.14 26.07,7.14 25.57,7.65 25.57,9.74 24.64,10.67 24.64,12.18 24.12,12.7 22.99,12.7 | U$2.D-2 22.99,12.7
FS_CS
  Bottom 0.152: U1500.2 8.38,20.32 14.35,20.32 R1501.2
GND  (via drill 0.35)
  Top 0.152: U100.49 13.72,13.46 13.72,11.56 13.79,11.56 13.79,10.54 v14.35,10.54 | U100.49 12.06,13.59 v12.06,13.97 | U100.49 10.04,11.56 10.04,11.05 | U$3.2 24,4.69 U$3.EXP | C202.2 24.19,20.86 24.19,20.89 24.12,20.96 U200.P$30 | Q1.2 27.58,21.02 27.58,20.07 | U$2.GND2 21.36,16.38 21.34,16.38
  Top 0.254: L115.2 19.19,11 19.19,10.74 20.19,9.73 C3.2
  Top 0.305: U$2.GND2 21.95,15.65
  Top 0.406: U$2.GND1 20.54,9.25 C3.2
  Bottom 0.152: JOY.GND 13.97,4.32 13.46,4.83 v13.46,5.46
  other vias: 10.92,26.21 10.92,27.56 7.62,17.46 19.81,5.33 20.95,6.73 4.83,8.38 8.38,10.79 24.13,15.37 19.56,15.37 24.89,17.02 22.86,1.14 6.35,15.68 25.15,22.61 27.18,22.61 25.02,8.64 23.37,7.11 27.3,6.22
  pour Top: -2.54,36.83 31.75,36.83 31.75,-3.81 19.68,-3.81 19.68,5.21 -2.54,5.21
  pour Bottom: -1.27,35.56 30.48,35.56 30.48,-2.54 19.68,-2.54 19.68,5.21 -1.27,5.21
GND_BATT  (via drill 0.35)
  Top 0.406: NEG.1 v25.15,28.07
  Bottom 0.406: U1550.3 12.89,22.73 | 12.89,22.73 9.33,22.73 U1500.6 9.33,25.12 C1503.2 | 12.89,22.73 14.35,22.73 R1501.1 14.87,23.07 15.69,23.9 15.69,25.09 15.96,25.36 22.44,25.36 v25.15,28.07
GPIO0  (via drill 0.35)
  Top 0.152: U100.23 10.71,16.4 10.19,16.93 9.8,16.93 9.27,17.46 v9.24,17.46 | v16.51,7.28 16.83,7.28 17.48,7.92 17.48,8.95 17.83,9.3 19,9.3 19.12,9.18 19.12,7.54 18.89,7.32 18.89,6.15 19.01,6.03 21,6.03 21.58,6.6 21.59,6.6 21.72,6.73 22.99,6.73 23.25,6.46 U$3.23
  Bottom 0.152: JOY.CTR 13.97,8 14.69,7.28 v16.51,7.28 17.07,7.28 17.8,8.01 17.8,9.42 18.21,9.82 18.21,10.5 17.8,10.9 17.8,13.63 16.05,15.39 15.29,15.39 14.77,15.91 10.81,15.91 9.27,17.46 v9.24,17.46
GPIO2  (via drill 0.35)
  Top 0.152: v10.02,17.46 10.05,17.46 10.58,16.93 10.94,16.93 11.06,16.8 U100.22
  Bottom 0.152: JOY.A 12.57,8 13.58,7 16.04,7 16.29,6.75 16.73,6.75 16.98,7 17.19,7 18.09,7.9 18.09,9.3 18.49,9.71 18.49,10.61 18.09,11.02 18.09,13.75 16.16,15.67 15.41,15.67 14.89,16.19 11.32,16.19 10.05,17.46 v10.02,17.46
GPIO4  (via drill 0.35)
  Top 0.152: U100.24 10.36,16.36 10.07,16.65 9.68,16.65 9.4,16.93 8.99,16.93 v8.46,17.46
  Bottom 0.152: JOY.C 15.97,7.81 17.2,7.81 17.53,8.13 17.53,9.54 17.93,9.94 17.93,10.38 17.53,10.78 17.53,13.52 15.93,15.11 15.18,15.11 14.65,15.63 10.31,15.63 8.49,17.46 v8.46,17.46
GPIO13  (via drill 0.35)
  Top 0.152: U100.20 11.76,17.28 v11.58,17.46
  Bottom 0.152: JOY.D 15.37,3.17 14.86,3.68 14.25,3.68 14.25,5.59 14.85,6.19 16.96,6.19 17.19,6.41 17.39,6.41 18.64,7.67 18.64,9.07 19.05,9.48 19.05,10.84 18.64,11.25 18.64,13.98 16.39,16.23 15.64,16.23 15.12,16.75 12.3,16.75 11.6,17.46 v11.58,17.46
GPIO14  (via drill 0.35)
  Top 0.152: U100.17 12.88,16.03 12.88,16.71 13.47,17.3 v14.15,17.3 | R6.1 26.54,17.82 25.85,17.13 25.85,15.18 v25.02,14.35
  Bottom 0.152: v14.15,17.3 14.97,17.3 15.76,16.51 16.51,16.51 20.36,12.66 20.36,12.58 20.48,12.46 22.45,12.46 22.57,12.58 22.57,13.16 23.53,14.12 24.79,14.12 v25.02,14.35
GPIO15  (via drill 0.35)
  Top 0.152: U100.21 11.41,16.85 v10.8,17.46
  Bottom 0.152: JOY.B 12.57,4.58 12.78,4.79 12.78,5.59 13.65,6.47 16.85,6.47 17.1,6.72 17.3,6.72 18.36,7.78 18.36,9.19 18.77,9.59 18.77,10.73 18.36,11.13 18.36,13.87 16.28,15.95 15.53,15.95 15,16.47 11.82,16.47 10.83,17.46 v10.8,17.46
GPIO16
  Top 0.152: U1.8 6.23,18.11 6.3,18.11 6.42,17.99 6.42,17.78 6.42,17.49 8.18,15.74 U100.25
LNA_IN
  Top 0.152: U100.2 16.66,11.54 L115.1 17.57,10.92 17.91,10.92 18.41,10.41 C115.2
N$3
  Bottom 0.152: R2004.1 R2005.2 16.32,23.14 U2000.3
N$4
  Bottom 0.152: U1000.2 2.92,27.22 R1001.2
N$5
  Top 0.152: R6.2 25.21,21.23 Q1.1
N$7
  Top 0.152: C115.1 17.84,7.97 17.84,6.63 C116.1 17.95,6.45 E1.ANT
N$8
  Bottom 0.406: U2100.3 19.25,19.92 L2100.P$1
N$9
  Bottom 0.152: U2100.5 23.45,21.34 R2102.1 R2103.2
N$10
  Top 0.152: U200.P$26 21.32,20.55 R202.2
N$11
  Top 0.152: U200.P$27 22.02,21.02 22.1,20.95 22.26,20.95 23.02,20.19 C202.1
N$12
  Top 0.152: U200.P$4 5.92,20.54 C200.1
N$13
  Top 0.152: U200.P$5 6.62,21.54 C200.2
N$14
  Top 0.152: U200.P$2 4.52,21.5 C201.1
N$15
  Top 0.152: U200.P$3 5.22,20.5 C201.2
N$16
  Top 0.152: U200.P$28 22.72,21.16 22.99,20.9 23.79,20.9 23.91,20.78 23.91,19.55 23.15,18.8 C203.1
OC
  Bottom 0.152: U1550.6 10.99,21.97 9.84,21.97 9.84,21.98 8,21.98 7.43,21.42 U1500.3
OD
  Bottom 0.152: U1500.1 9.33,20.6 12.89,20.6 U1550.4
PIEZO_GND
  Top 0.152: Q1.3 26.16,24.51 PIEZO-.1
RESET  (via drill 0.35)
  Top 0.152: U100.9 14.86,13.99 15.07,14.2 15.07,14.22 15.24,14.39 15.24,17.27 16.18,18.21 16.18,18.87 16.3,18.99 19.27,18.99 R2.1 19.94,18.25 v19.94,17.02 | v24.65,7.57 24.83,7.39 25.26,7.39 25.57,7.08 25.57,6.64 25.25,6.32 U$3.19
  Bottom 0.152: v19.94,17.02 20.47,17.55 21.05,17.55 21.13,17.47 23.59,17.47 25.83,15.23 25.83,14.02 25.36,13.54 25.09,13.54 24.55,13 24.55,8.91 24.49,8.86 24.49,8.42 24.55,8.36 24.55,7.67 v24.65,7.57
SCK/CLK
  Top 0.152: U100.31 8.18,13.64 8.08,13.54 8,13.54 7.58,13.12 7.54,13.08 7.21,12.75 4.43,12.75 3.56,11.88 U300.6
SCL  (via drill 0.35)
  Top 0.152: U100.16 13.16,16.59 13.34,16.76 14.43,16.76 14.68,17.02 14.68,17.5 15.26,18.09 15.26,19.24 15.49,19.47 15.49,20.11 R201.1 15.72,20.33 U200.P$18 15.72,25.43 v15.37,25.78 | U1.14 1.45,17.64 1.1,17.64 1.1,19.44 1.28,19.61 1.28,20.98 2.52,22.21 2.52,24.7 3.11,25.3 11.96,25.3 v12.57,25.91
  Bottom 0.152: v15.37,25.78 15.27,25.88 12.6,25.88 v12.57,25.91
SCS/CMD
  Top 0.152: U100.30 8.13,13.99 7.97,13.82 7.88,13.82 7.09,13.03 3.84,13.03 3.05,12.25 3.05,10.88 3.09,10.84 3.17,10.76 3.57,10.76 3.79,10.54 3.79,9.26 1.02,6.49 U300.1
SDA
  Top 0.152: R200.1 16.42,20.7 U200.P$19 16.42,24.6 16,25.02 16,25.9 15.59,26.31 15.15,26.31 13.86,25.02 3.23,25.02 2.79,24.58 2.79,22.1 1.56,20.86 U1.13 | R200.1 15.98,19.25 15.66,19.25 15.54,19.13 15.54,17.97 14.96,17.39 14.96,16.9 14.55,16.48 13.56,16.48 13.51,16.43 U100.15 | R200.1 17.12,20.19 U200.P$20
SDI/SD1
  Top 0.152: U100.33 8.19,12.94 7.44,12.19 4.88,12.19 4.83,12.14 U300.5
SDO/SD0
  Top 0.152: U100.32 8.22,13.29 8.2,13.26 8.12,13.26 7.33,12.47 4.55,12.47 4.32,12.25 4.32,9.4 2.29,7.37 U300.2
SENSOR_CAPN
  Top 0.152: C104.1 17.55,17.21 15.97,17.21 15.8,17.04 15.8,14.15 15.63,13.99 15.63,13.82 15.09,13.29 U100.7
SENSOR_CAPP
  Top 0.152: C105.2 16.93,16.45 16.19,15.71 16.19,14.15 15.91,13.87 15.91,13.48 15.36,12.94 U100.6
SENSOR_VN
  Top 0.152: C104.2 16.8,18.29 16,17.49 15.86,17.49 15.52,17.16 15.52,14.27 15.35,14.1 15.35,13.94 15.05,13.64 U100.8
SENSOR_VP  (via drill 0.35)
  Top 0.152: U100.5 15.41,12.59 16.19,13.37 16.19,13.75 16.31,13.87 17.56,13.87 17.97,14.28 17.97,15.45 18.63,16.12 C105.1 v18.41,16.51 | R4.1 R5.2 1.45,24.92 2.11,25.58 11.49,25.58 12.35,26.44 12.79,26.44 13.39,25.85 14.29,25.85 15.03,26.59 23.62,26.59 24.94,25.27 24.94,23.57 26.29,22.23 26.29,20.83 26.51,20.6 27.18,20.6 27.3,20.48 27.3,19.32 27.18,19.2 25.91,19.2 25.62,19.49 24.72,19.49 24.1,18.87 24.1,16.18 v24.13,16.15
  Bottom 0.152: v18.41,16.51 18.94,16.51 19.5,15.95 20.38,15.95 20.49,16.06 23.59,16.06 23.67,16.15 v24.13,16.15
SHD/SD2
  Top 0.152: U100.28 8.16,14.69 7.97,14.88 7.39,14.88 5.82,13.31 3.66,13.31 2.29,11.94 U300.7
STDBY
  Bottom 0.152: U1000.6 4.19,19.43 4.57,19.05 4.57,18.67 5.25,18 R1007.2
STDBY_3V3
  Bottom 0.152: R1007.1 R1009.2
SWP/SD3  (via drill 0.35)
  Top 0.152: U100.29 7.76,14.34 7.65,14.22 v7.54,14.22 | v3.56,7.37 U300.3
  Bottom 0.152: v3.56,7.37 4.29,8.11 4.29,8.6 7.54,11.84 v7.54,14.22
U100RXD  (via drill 0.35)
  Top 0.152: U100.40 10.71,10.45 10.34,10.08 10.18,10.08 v9.63,9.53 | U$3.21 v24.25,6.85 v24.26,6.86
  Bottom 0.152: v9.63,9.53 9.38,9.78 8.52,9.78 8.03,9.28 8.03,2.78 10.2,0.61 24.98,0.61 26.26,1.89 26.26,5.24 25.17,6.33 24.79,6.33 v24.26,6.86
U100TXD  (via drill 0.35)
  Top 0.152: U100.41 11.06,10.39 10.41,9.74 v10.41,9.53 | U$3.20 24.75,6.57 v25.04,6.86
  Bottom 0.152: v10.41,9.53 10.38,9.53 9.85,10.06 8.4,10.06 7.75,9.4 7.75,2.67 10.08,0.33 25.09,0.33 26.54,1.78 26.54,5.35 v25.04,6.86
V_BATT  (via drill 0.35)
  Top 0.152: R4.2 1.56,28.19 v4.7,28.19
  Top 0.406: v4.7,28.19 4.7,29.72 4.19,30.23 POS.1
  Bottom 0.406: U1000.5 6.8,21.07 6.8,21.92 7.28,22.39 8,22.39 8.38,22.77 U1500.5 8.38,25.78 8.29,25.78 C1503.1 8.04,26.89 | L2000.P$1 20.95,26.02 17.27,26.02 U2000.5 17.14,26.93 16.45,26.93 U2000.4 16.2,26.93 14.35,26.93 C1.1 14.1,26.89 8.04,26.89 | v4.7,28.19 6.01,26.89 8.04,26.89
V_USB  (via drill 0.35)
  Top 0.152: U$3.8 U$3.7 22.73,2.04 22.73,1.88 21.09,1.88 v20.55,2.41
  Bottom 0.152: R3.2 23.66,5.89 22.35,5.89 | v20.55,2.41 20.55,4.1 22.35,5.89 | F1.1 22.4,14.4 24.32,14.4 24.8,14.88 25.24,14.88 25.55,14.57 25.55,14.13 25.24,13.82 24.51,13.82 24.28,13.59 24.28,13.37 24.27,13.36 24.27,9.79 23.83,9.35 23.83,9.29 23.37,8.83 21.76,8.83 21.42,8.49 21.42,7.76 22.35,6.83 22.35,5.89
  Bottom 0.406: U1000.4 5.46,24.13 5.34,24.01 1.72,24.01 1.53,23.82 1.53,21.14 1.65,21.02 U1000.8 1.65,17.53 2.01,17.16 6.02,17.16 7.61,18.75 14.09,18.75 15.88,16.97 16.31,16.97 16.36,16.92 16.68,16.92 20.13,13.46 F1.1
V_USB_UNFUSED  (via drill 0.35)
  Top 0.305: U$2.V+1 22.63,10.05 22.87,10.29 23.37,10.29 v23.75,10.67 v23.74,10.67 | v23.75,13.59 23.75,13.97 23.11,14.61 22.87,14.61 22.63,14.85 U$2.V+2
  Bottom 0.305: v23.75,13.59 23.74,13.58 v23.74,10.67 F1.2
VDD_SDIO
  Top 0.152: U300.8 1.02,12.74 C300.1 3.07,13.12 3.54,13.59 5.7,13.59 7.5,15.39 U100.26
XTAL_P  (via drill 0.35)
  Top 0.152: v12.45,9.8 12.46,9.82 U100.45
  Bottom 0.152: C113.2 15.11,12.21 Y100.1 12.45,11.41 v12.45,9.8
XTAN_N  (via drill 0.35)
  Top 0.152: U100.44 12.11,10.32 11.47,9.68 v11.47,9.55
  Bottom 0.152: C114.2 10.89,13.93 Y100.3 11.69,13.15 11.69,9.78 v11.47,9.55

### Text on the board
tNames: + | - | Tamagotya | Industrial Design / by G. Eusebio | rev 0
Measures: 32mm | 28mm
Document: TODO: / ESP32 TX/RX/RST/GPIO-0 breakout / I2C breakout?